# EAGLE design BeerCannon (EAGLE 7.2.0)
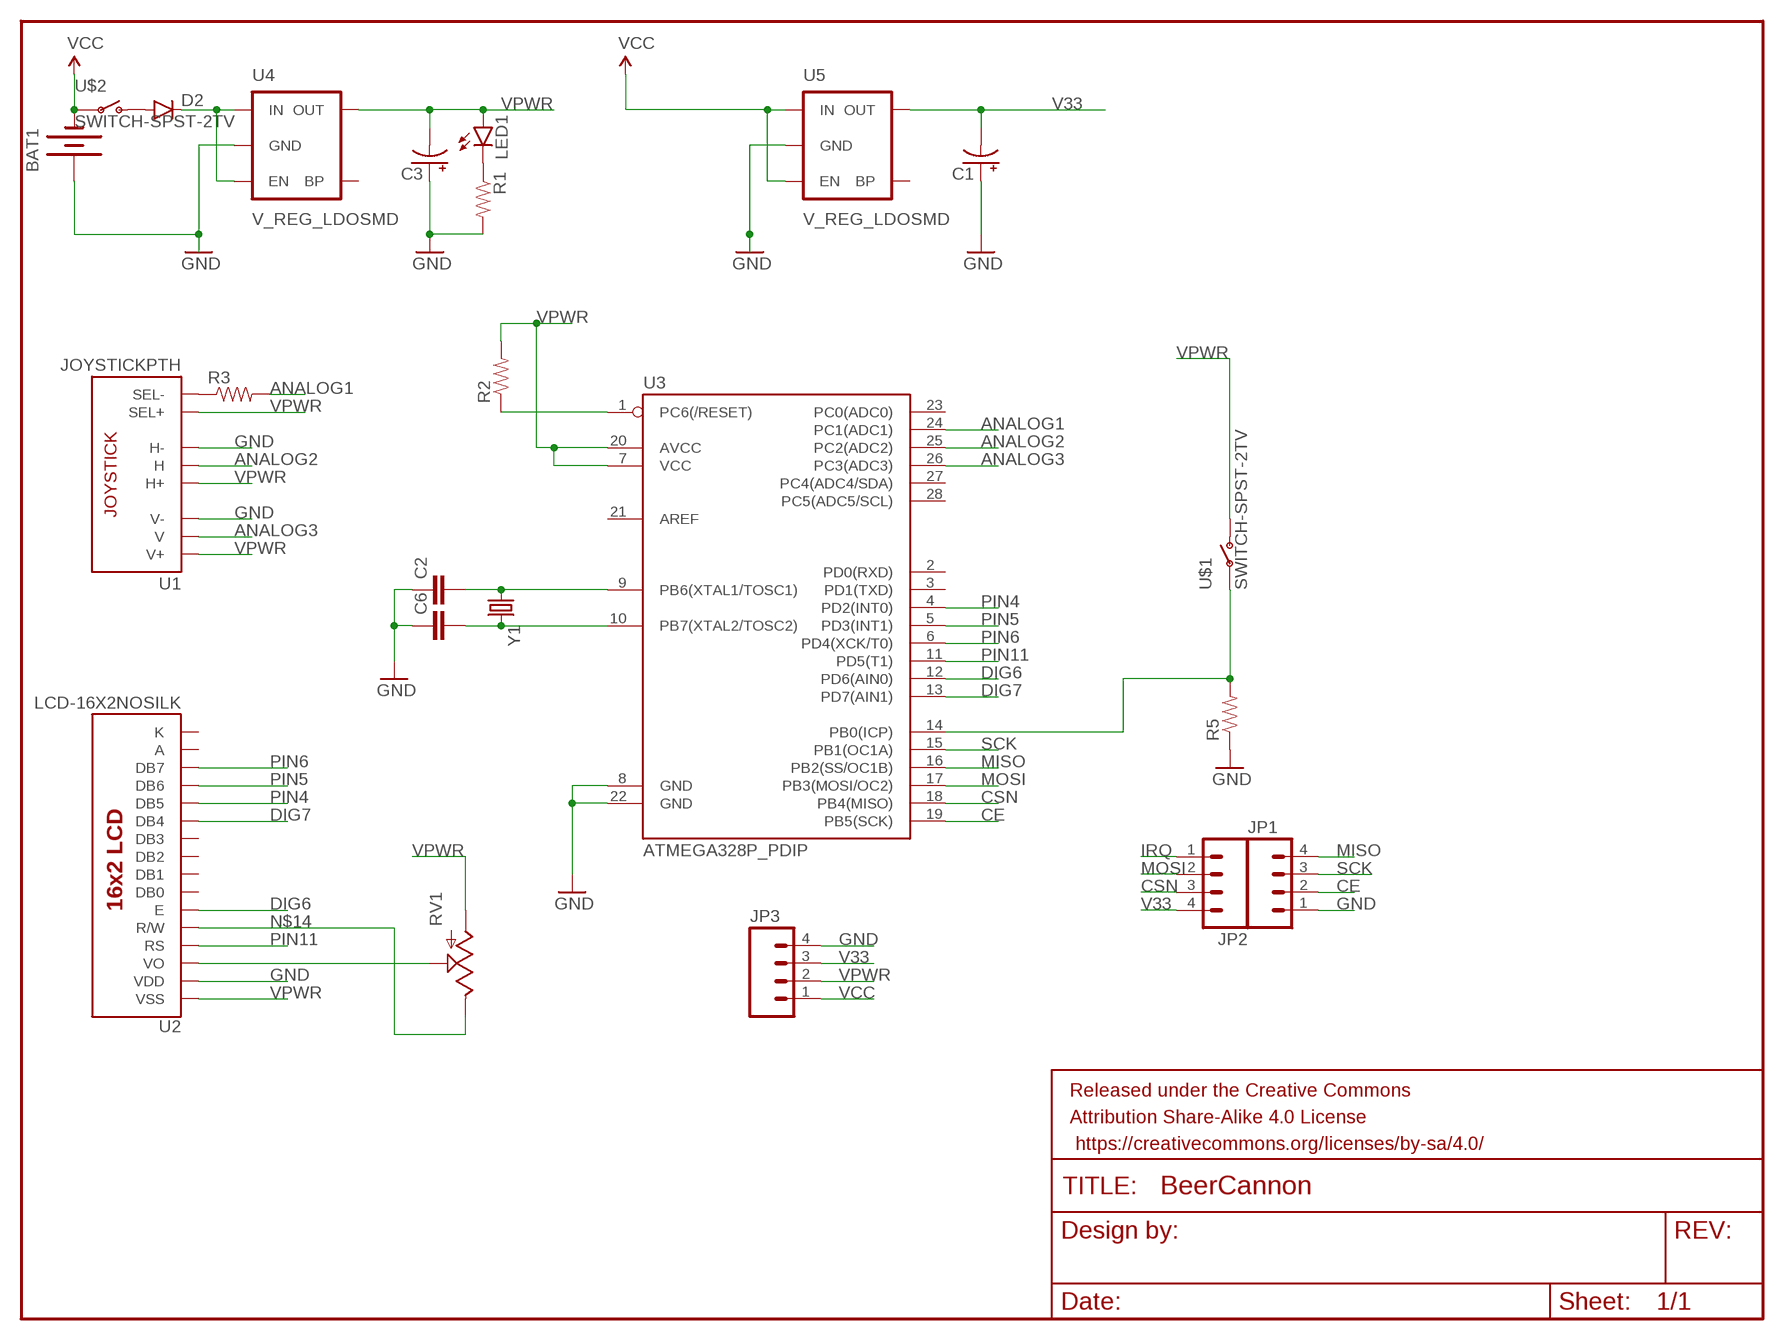
[diagram p0: schematic, sheet 1]

## Parts
BAT1  BATTERY9V  [BATTCON_9V]
C1  CAP_POL1206  [EIA3216]
C2  CAP1206  [1206]
C3  CAP_POL1206  [EIA3216]
C6  CAP1206  [1206]
D2  DIODESMA  [SMA-DIODE]
FRAME1  FRAME-LETTER  [CREATIVE_COMMONS]
JP1  M04PTH  [1X04]
JP2  M04PTH  [1X04]
JP3  M04PTH  [1X04]
LED1  LED1206  [LED-1206]
R1  RESISTOR1206  [1206]
R2  RESISTOR1206  [1206]
R3  RESISTOR1206  [1206]
R5  RESISTOR1206  [1206]
RV1  POT  [ALPS_POT]
U1  JOYSTICKPTH  [JOYSTICK]
U2  LCD-16X2NOSILK  [LCD-16X2_NOSILK]
U3  ATMEGA328P_PDIP  [DIL28-3]
U4  V_REG_LDOSMD  [SOT23-5]
U5  V_REG_LDOSMD  [SOT23-5]
U$1  SWITCH-SPST-2TV  [SWITCH-SPST-VERTICAL]
U$2  SWITCH-SPST-2TV  [SWITCH-SPST-VERTICAL]
Y1  CRYSTALSMD  [HC49UP]

## Nets
ANALOG1: R3.2 U3.24(PC1(ADC1))
ANALOG2: U1.H2(H) U3.25(PC2(ADC2))
ANALOG3: U1.V2(V) U3.26(PC3(ADC3))
CE: JP1.2 U3.19(PB5(SCK))
CSN: JP2.3 U3.18(PB4(MISO))
DIG6: U2.6(E) U3.12(PD6(AIN0))
DIG7: U2.11(DB4) U3.13(PD7(AIN1))
GND: BAT1.+ C1.A(+) C2.1 C3.A(+) C6.1 JP1.1 JP3.4 R1.2 R5.1 U1.H3(H-) U1.V3(V-) U2.2(VDD) U3.8(GND) U3.22(GND) U4.2(GND) U5.2(GND)
IRQ: JP2.1
MISO: JP1.4 U3.16(PB2(SS/OC1B))
MOSI: JP2.2 U3.17(PB3(MOSI/OC2))
N$1: LED1.C R1.1
N$2: D2.A U$2.1(O)
N$3: R3.1 U1.B2A(SEL-)
N$4: R2.1 U3.1(PC6(/RESET))
N$7: C2.2 U3.9(PB6(XTAL1/TOSC1)) Y1.1
N$8: C6.2 U3.10(PB7(XTAL2/TOSC2)) Y1.2
N$10: D2.C U4.1(IN) U4.3(EN)
N$12: RV1.P$2(S) U2.3(VO)
N$13: R5.2 U3.14(PB0(ICP)) U$1.2(P)
N$14: RV1.P$1(E) U2.5(R/W)
PIN4: U2.12(DB5) U3.4(PD2(INT0))
PIN5: U2.13(DB6) U3.5(PD3(INT1))
PIN6: U2.14(DB7) U3.6(PD4(XCK/T0))
PIN11: U2.4(RS) U3.11(PD5(T1))
SCK: JP1.3 U3.15(PB1(OC1A))
V33: C1.C(-) JP2.4 JP3.3 U5.5(OUT)
VCC: BAT1.- JP3.1 U5.1(IN) U5.3(EN) U$2.2(P)
VPWR: C3.C(-) JP3.2 LED1.A R2.2 RV1.P$3(A) U1.B1A(SEL+) U1.H1(H+) U1.V1(V+) U2.1(VSS) U3.7(VCC) U3.20(AVCC) U4.5(OUT) U$1.1(O)
Unconnected: U2.7(DB0) U2.8(DB1) U2.9(DB2) U2.10(DB3) U3.2(PD0(RXD)) U3.3(PD1(TXD)) U3.21(AREF) U3.23(PC0(ADC0)) U3.27(PC4(ADC4/SDA)) U3.28(PC5(ADC5/SCL)) U4.4(BP) U5.4(BP)

## Power pins joined to a net without a drawn wire
A: U2.15(A)
K: U2.16(K)

## Library data of the parts
BAT1 = SparkFun-Electromechanical:BATTERY: Battery Holders Various common sizes : AA, AAA, 18650 (PRT-12895), 20mm coin cell and 12mm coin cell. 20MM_4LEGS, BATT-10373
C1 C3 = SparkFun-Passives:CAP_POL: Capacitor Polarized These are standard SMD and PTH capacitors. Normally 10uF, 47uF, and 100uF in electrolytic and tantalum varieties. Always verify the external diameter of the through hole cap, it varies with capacity, voltage, and manufacturer. The EIA devices should be standard.
C2 C6 = SparkFun-Passives:CAP: Capacitor Standard 0603 ceramic capacitor, and 0.1" leaded capacitor.
D2 = SparkFun-DiscreteSemi:DIODE: Diode These are standard reverse protection diodes and small signal diodes. SMA package can handle up to about 1A. SOD-323 can handle about 200mA. What the SOD-323 package when ordering, there are some mfgs out there that are 5-pin packages.
FRAME1 = SparkFun-Aesthetics:FRAME-LETTER: Schematic Frame Standard 8.5x11 US Letter frame
JP1-JP3 = SparkFun-Connectors:M04: Header 4 Standard 4-pin 0.1" header. Use with straight break away headers (SKU : PRT-00116), right angle break away headers (PRT-00553), swiss pins (PRT-00743), machine pins (PRT-00117), and female headers (PRT-00115). Molex polarized connector foot print use with SKU : PRT-08231 with associated crimp pins and housings. 1MM SMD Version SKU: PRT-10208
LED1 = SparkFun-LED:LED: LEDs Standard schematic elements and footprints for 5mm, 3mm, 1206, and 0603 sized LEDs. 5mm - Spark Fun Electronics SKU : COM-00529 (and others)
R1-R3 R5 = SparkFun-Passives:RESISTOR: Resistor Basic schematic elements and footprints for 0603, 1206, and PTH resistors.
RV1 = SparkFun-Electromechanical:POT
U1 = SparkFun-Electromechanical:JOYSTICK: Thumb Joystick Joystick commonly found in PS2 controllers. Two pots and a select switch. Footprint proven. Spark Fun Electronics SKU : COM-09032
U2 = SparkFun-Displays:LCD-16X2: Standard text-only 16x2 parallel input LCD
U3 = SparkFun-DigitalIC:ATMEGA328P_PDIP: uC used in the Arduino 32kb flash, 1k EEPROM, 2k SRAM This is the through-hole version of this chip.
U4 U5 = SparkFun-PowerIC:V_REG_LDO: Voltage Regulator LDO Standard 150mA LDO voltage regulator in SOT-23 layout. Micrel part MIC5205. BP (by-pass) pin is used to lower output noise with 470pF cap.
U$1 U$2 = SparkFun-Electromechanical:SWITCH-SPST-2
Y1 = SparkFun-FreqCtrl:CRYSTAL: Various standard crystals. Proven footprints.

## Board
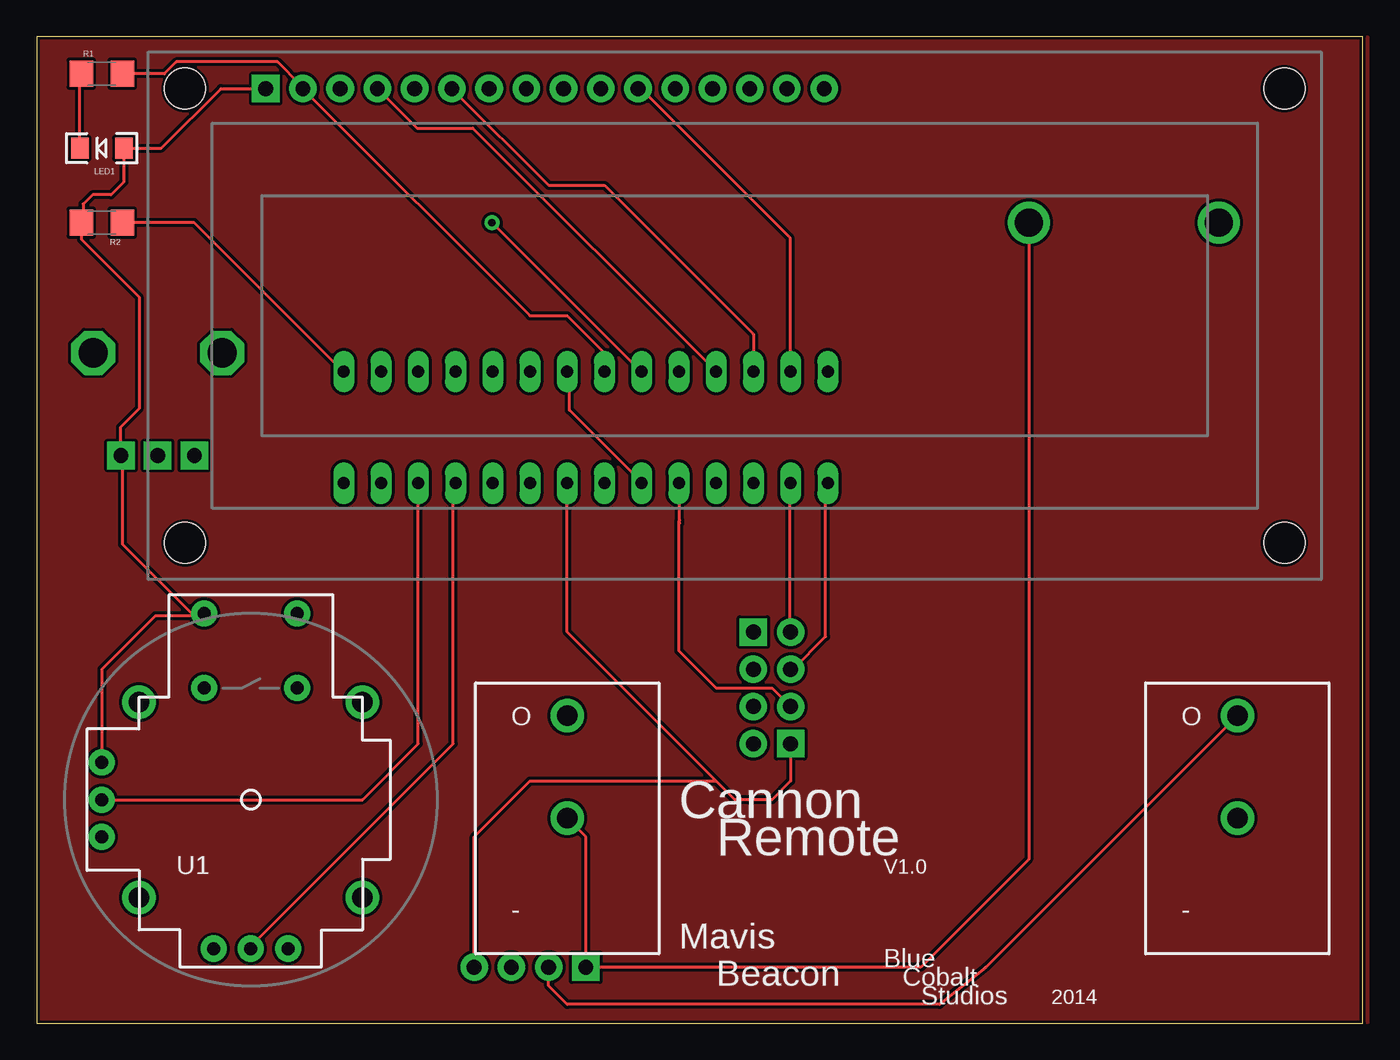
[diagram p1: board, top side]
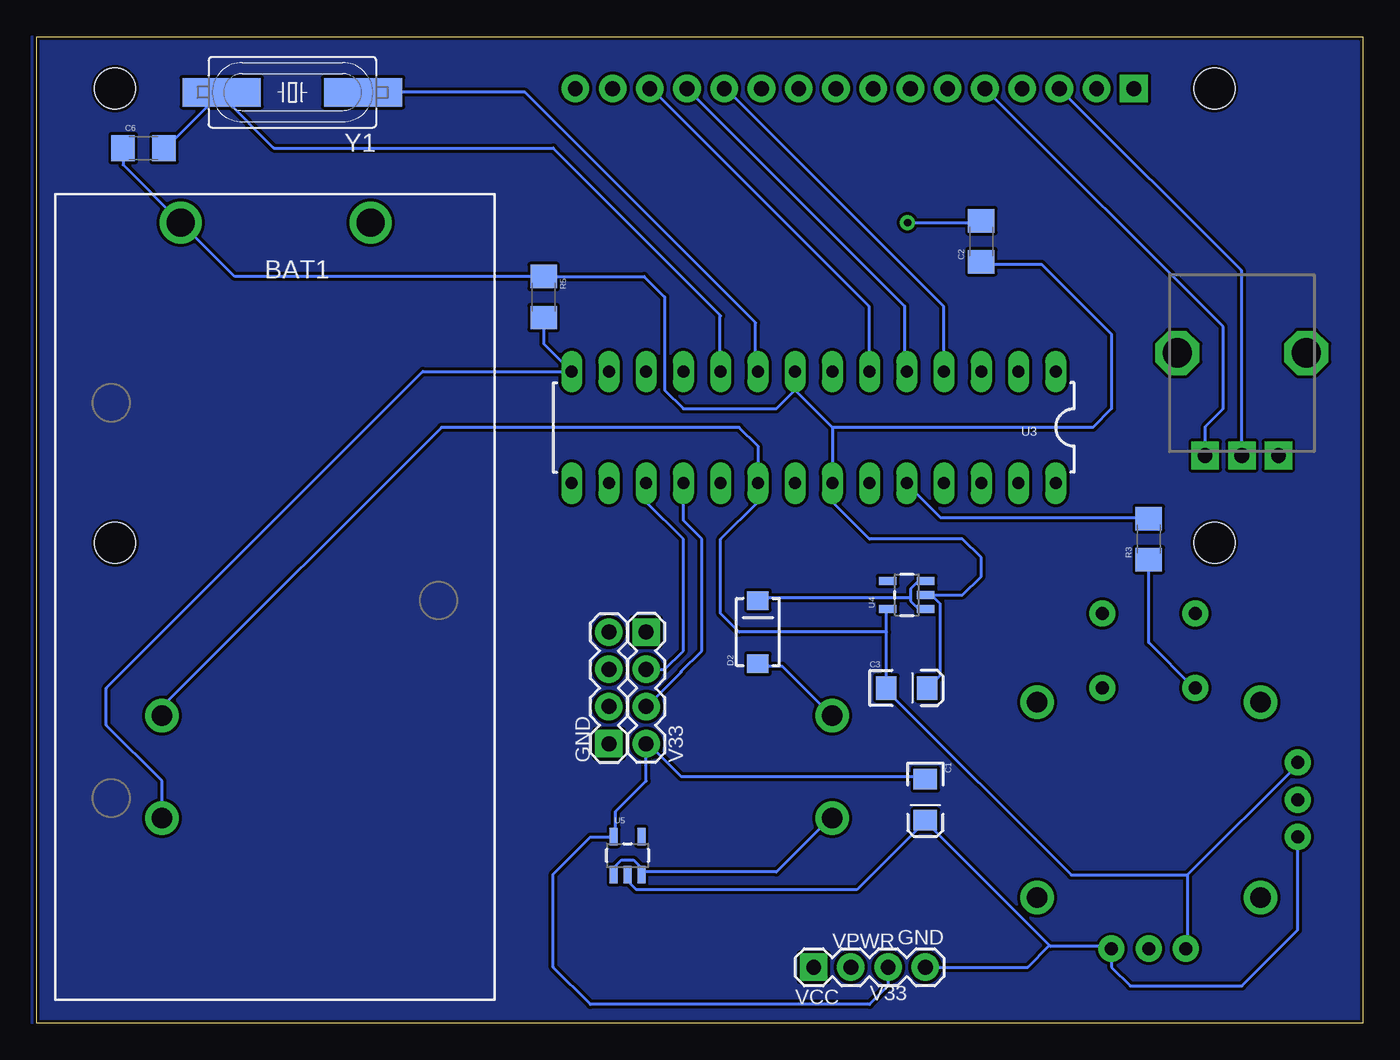
[diagram p2: board, bottom side, seen from below]

Size 90.47 x 67.3 mm. Coordinates in mm from the lower left corner, seen from the top.
Outline: 0,0 90.47,0 90.47,67.3 0,67.3 0,0
Copper layers (1*16): Top 0.035mm / dielectric 1.5mm / Bottom 0.035mm
Design rules "SparkFun *": minimum track width 8mil, minimum drill 20mil, track to track 8mil, track to pad 8mil, pad to pad 8mil, via to via 8mil, smd to smd 8mil, copper to edge 8mil, drill to drill 8mil, minimum pad ring 12mil, minimum via ring 10mil, stop-mask expansion 4mil, vias tented up to drill 20mil, thermal gap 10mil

### Footprints (pad centres in the part's own frame; a part is rotated, then mirrored left to right if it is on the bottom)
BATTCON_9V = drill 1.905: + 0,0; - 0,-12.954
EIA3216 = smd 1.4 x 1.6: A 1.4,0; C -1.4,0
1206 = smd 1.6 x 1.8: 1 -1.4,0; 2 1.4,0
SMA-DIODE = smd 1.27 x 1.47: A -2.15,0; C 2.15,0
1X04 = drill 1.016 pad 1.88 square: 1 0,0 | drill 1.016 pad 1.88: 2 2.54,0; 3 5.08,0; 4 7.62,0
LED-1206 = smd 1.2 x 1.4: A -1.5,0; C 1.5,0
ALPS_POT = drill 1 pad 1.88 square: P$1 7,-2.5; P$2 7,0; P$3 7,2.5 | drill 2 octagon: P$4 0,-4.4; P$5 0,4.4
JOYSTICK = drill 0.9 pad 1.778: B1A -3.175,12.7; B1B 3.175,12.7; B2A -3.175,7.62; B2B 3.175,7.62 | drill 0.889 pad 1.778: H1 -2.54,-10.16; H2 0,-10.16; H3 2.54,-10.16; V1 -10.16,2.54; V2 -10.16,0; V3 -10.16,-2.54 | drill 1.397 pad 2.286: MOUNT1 -7.62,6.668; MOUNT2 -7.62,-6.668; MOUNT3 7.62,-6.668; MOUNT4 7.62,6.668
LCD-16X2_NOSILK = drill 1.016 pad 1.88 square: 1 -32,15.5 | drill 1.016 pad 1.88: 2 -29.46,15.5; 3 -26.92,15.5; 4 -24.38,15.5; 5 -21.84,15.5; 6 -19.3,15.5; 7 -16.76,15.5; 8 -14.22,15.5; 9 -11.68,15.5; 10 -9.14,15.5; 11 -6.6,15.5; 12 -4.06,15.5; 13 -1.52,15.5; 14 1.02,15.5; 15 3.56,15.5; 16 6.1,15.5 | hole 2.8: -37.5,15.5; -37.5,-15.5; 37.5,15.5; 37.5,-15.5
DIL28-3 = drill 0.813 long: 1 -16.51,-3.81; 2 -13.97,-3.81; 3 -11.43,-3.81; 4 -8.89,-3.81; 5 -6.35,-3.81; 6 -3.81,-3.81; 7 -1.27,-3.81; 8 1.27,-3.81; 9 3.81,-3.81; 10 6.35,-3.81; 11 8.89,-3.81; 12 11.43,-3.81; 13 13.97,-3.81; 14 16.51,-3.81; 15 16.51,3.81; 16 13.97,3.81; 17 11.43,3.81; 18 8.89,3.81; 19 6.35,3.81; 20 3.81,3.81; 21 1.27,3.81; 22 -1.27,3.81; 23 -3.81,3.81; 24 -6.35,3.81; 25 -8.89,3.81; 26 -11.43,3.81; 27 -13.97,3.81; 28 -16.51,3.81
SOT23-5 = smd 0.55 x 1.2: 1 -0.95,-1.3; 2 0,-1.3; 3 0.95,-1.3; 4 0.95,1.3; 5 -0.95,1.3
SWITCH-SPST-VERTICAL = drill 1.4 pad 2.286: 1 0,7; 2 0,0
HC49UP = smd 5.334 x 1.93: 1 -4.826,0; 2 4.826,0

### Placement (x,y rotation side)
BAT1  80.64,54.61 90 bottom
C1  29.84,15.24 270 bottom
C2  26.04,53.34 90 bottom
C3  31.11,22.86 0 bottom
C6  83.18,59.69 0 bottom
D2  41.27,26.67 90 bottom
FRAME1  -78.11,77.47 0 top  (outside the outline)
JP1  51.44,19.05 90 bottom
JP2  48.9,26.67 270 bottom
JP3  37.47,3.81 0 bottom
LED1  4.45,59.69 180 top
R1  4.45,64.77 0 top
R2  4.45,54.61 180 top
R3  14.61,33.02 90 bottom
R5  55.88,49.53 270 bottom
RV1  8.26,45.72 270 bottom
U1  14.61,15.24 0 top
U2  47.62,48.26 0 top
U3  37.47,40.64 180 bottom
U4  31.11,29.21 90 bottom
U5  50.16,11.43 0 bottom
U$1  81.91,13.97 0 top
U$2  36.2,13.97 0 top
Y1  73.02,63.5 180 bottom

### Tracks (layer width: path | path; a pad name or v marks a point on that pad's centre or on a via)
ANALOG1
  Bottom 0.203: R3.2 14.61,34.49 28.83,34.49 31.06,36.73 U3.24
ANALOG2
  Top 0.203: U3.25 28.42,36.73 28.42,19.05 14.61,5.23 U1.H2
ANALOG3
  Top 0.203: 25.98,36.73 U3.26 | 4.45,15.39 U1.V2 22.22,15.24 26.04,19.05 U3.26 | 25.98,36.78 U3.26
CE
  Top 0.203: 43.87,34.09 43.87,34.29 | 43.87,34.29 43.87,36.73 U3.19 | 51.38,21.69 JP1.2 50.16,22.86 46.36,22.86 43.82,25.4 43.82,34.24 43.87,34.29
CSN
  Bottom 0.203: 46.51,36.73 U3.18 46.36,34.29 45.09,33.02 45.09,25.4 46.51,23.98 46.51,23.93 48.74,21.69 JP2.3
DIG6
  Top 0.203: 48.74,44.45 U3.12 48.9,46.99 38.73,57.15 34.93,57.15 28.42,63.65 28.42,63.75 U2.6
DIG7
  Top 0.203: U3.13 51.38,44.45 51.38,53.59 41.22,63.75 U2.11
GND
  Top 0.203: R1.2 8.71,64.77 9.53,65.58 16.43,65.58 18.06,63.96 U2.2 18.26,63.75 18.26,63.65 33.66,48.26 36.2,48.26 38.73,45.72 U3.8 38.58,44.45 | JP1.1 51.44,16.51 50.16,15.24 47.62,15.24 46.36,16.51 | 46.36,16.51 36.2,26.67 U3.22 | JP3.4 29.84,12.7 33.66,16.51 46.36,16.51
  Bottom 0.203: 21.37,5.3 21.31,5.23 17.25,5.23 | 21.37,5.3 29.84,13.77 | 17.25,5.23 U1.H3 | 29.84,13.77 34.52,9.09 49.55,9.09 50.16,9.7 U5.2 50.16,10.11 | 29.84,13.77 C1.A | BAT1.+ 80.03,54 | 29.44,29.21 U4.2 29.64,29.21 | 29.44,29.21 28.83,28.6 28.83,23.72 29.64,22.91 C3.A | C2.1 26.19,51.76 21.92,51.76 17.14,46.99 17.14,41.91 18.41,40.64 36.2,40.64 | 38.58,44.45 U3.8 38.73,43.18 | 29.44,29.21 27.3,29.21 26.04,30.48 26.04,31.75 27.3,33.02 33.66,33.02 36.2,35.56 U3.22 36.2,40.64 | 38.73,43.18 36.2,40.64 | JP3.4 22.86,3.81 21.37,5.3 | 17.25,5.23 17.25,5.18 U1.H3 | U1.H3 17.14,3.81 15.88,2.54 8.26,2.54 4.45,6.35 U1.V3 | C6.1 84.58,58.55 BAT1.+ | BAT1.+ 76.96,50.93 R5.1 49.02,50.93 47.62,49.53 47.62,43.18 46.36,41.91 40.01,41.91 38.73,43.18
MISO
  Top 0.203: U3.16 51.38,36.73 51.38,26.77 JP1.4
MOSI
  Bottom 0.203: 48.95,36.73 U3.17 48.9,35.56 46.36,33.02 46.36,25.4 47.62,24.13 JP2.2 48.95,24.13
N$1
  Top 0.203: 3.23,64.77 R1.1 2.95,64.67 LED1.C
N$2
  Bottom 0.203: D2.A 41.22,24.33 39.6,24.33 36.35,21.08 U$2.1
N$3
  Bottom 0.203: R3.1 14.61,25.96 11.56,22.91 U1.B2A
N$4
  Top 0.203: U3.1 20.9,44.45 10.74,54.61 R2.1
N$5
  pour Top: 0.64,67.31 90.8,67.31 90.8,0 0,0 0,67.31
N$6
  pour Bottom: 0.64,67.31 90.8,67.31 90.8,0 0,0 0,66.67
N$7  (via drill 0.51)
  Top 0.203: v31.06,54.61 41.22,44.45 U3.9
  Bottom 0.203: v31.06,54.61 26.19,54.61 C2.2 | 68.05,63.35 Y1.1 57.15,63.5 41.43,47.78 41.43,44.45 U3.9
N$8
  Bottom 0.203: U3.10 43.87,44.45 43.87,48.21 43.82,48.26 55.25,59.69 74.3,59.69 77.8,63.2 77.8,63.35 Y1.2 81.66,59.69 C6.2
N$10
  Bottom 0.203: 30.86,29.01 30.86,29.62 30.45,30.02 29.84,30.02 U4.3 | 30.86,29.01 30.86,28.8 30.45,28.4 29.84,28.4 U4.1 | 30.86,29.01 41.22,29.01 D2.C
N$12
  Bottom 0.203: RV1.P$2 8.31,38.76 8.31,51.36 U2.3
N$13
  Bottom 0.203: R5.2 55.88,46.35 U3.14 64.13,44.45 85.72,22.86 85.72,20.32 81.91,16.51 U$1.2
N$14
  Bottom 0.203: RV1.P$1 10.74,38.76 10.74,40.69 9.53,41.91 9.53,47.5 U2.5
PIN4
  Bottom 0.203: U3.4 28.63,44.45 28.63,48.92 43.46,63.75 U2.12
PIN5
  Bottom 0.203: U3.5 31.27,44.45 31.27,48.92 U2.13
PIN6
  Bottom 0.203: U3.6 33.71,44.45 33.71,48.92 48.54,63.75 U2.14
PIN11
  Top 0.203: U3.11 46.3,44.45 46.3,44.5 29.74,61.06 25.94,61.06 U2.4 23.34,63.75
SCK
  Top 0.203: U3.15 53.82,36.73 53.82,26.37 51.59,24.13 JP1.3
V33
  Bottom 0.203: U5.5 50.98,12.75 50.98,14.43 48.9,16.51 JP2.4 | 48.95,19.05 JP2.4 | C1.C 29.84,16.82 46.51,16.82 48.74,19.05 JP2.4 | 51.18,12.55 U5.5 | U5.5 51.15,12.7 52.71,12.7 55.25,10.16 55.25,3.81 52.71,1.27 33.66,1.27 32.39,2.54 JP3.3
VCC
  Top 0.203: U$2.2 37.47,12.7 JP3.1 60.33,3.81 67.69,11.18 BAT1.-
  Bottom 0.203: U5.1 50.98,10.31 50.98,10.72 50.57,11.12 49.76,11.12 49.35,10.72 49.35,10.31 U5.3 49.15,10.31 40.01,10.31 36.35,13.97 U$2.2
VPWR
  Top 0.203: U2.1 12.57,63.75 8.51,59.69 LED1.A 5.95,57.38 5.08,56.51 3.81,56.51 3.17,55.88 3.17,54.74 R2.2 3.04,53.47 6.99,49.53 6.99,41.91 5.71,40.64 5.71,38.76 RV1.P$3 5.87,38.56 5.87,32.66 10.74,27.79 | U1.V1 4.45,24.13 8.1,27.79 10.74,27.79 | 10.74,27.79 11.35,27.79 U1.B1A 10.74,27.79 | 81.86,20.88 U$1.1 64.75,3.81 61.59,1.27 36.2,1.27 34.93,2.54 JP3.2 | U3.7 36.35,44.45 36.35,41.81 41.22,36.93 U3.20
  Bottom 0.203: 11.96,10.11 11.96,5.23 U1.H1 | 11.96,10.11 4.45,17.63 U1.V1 | 32.49,26.67 32.49,22.91 C3.C 32.49,22.71 19.89,10.11 11.96,10.11 | 32.49,26.67 32.49,28.19 U4.5 | 32.49,26.67 42.55,26.67 43.82,27.94 43.82,33.02 41.27,35.56 U3.20 41.27,39.37 42.55,40.64 62.87,40.64 81.91,21.59 U$1.1

### Text on the board
tPlace: Cannon | Remote | V1.0 | Mavis | Blue | Beacon | Cobalt | Studios | 2014
bPlace: V33 | GND | GND | VPWR | V33 | VCC